# EAGLE design arduino_motor_shield (EAGLE 5.06)
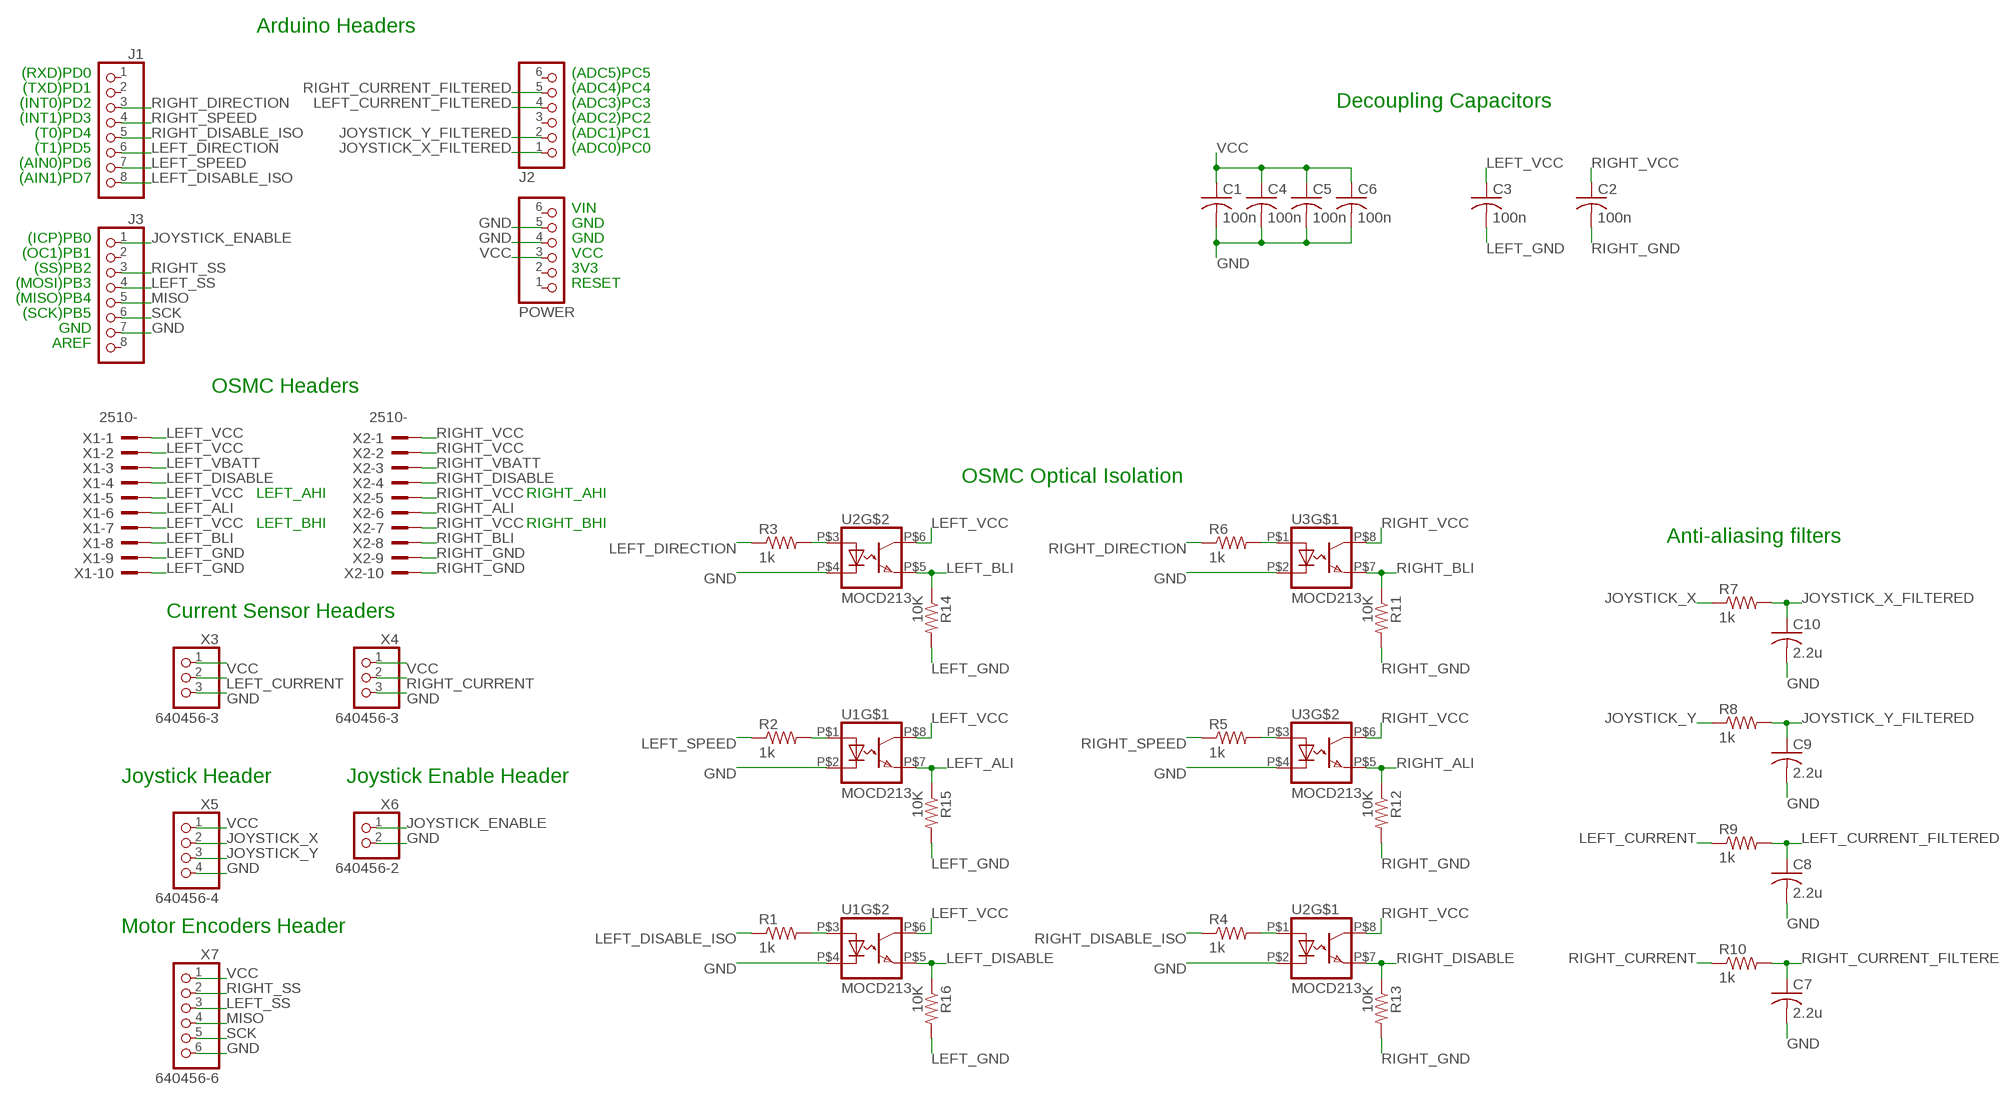
[diagram p0: schematic, sheet 1]

## Parts
C1  100n  C-USC0603  [C0603]
C2  100n  C-USC0603  [C0603]
C3  100n  C-USC0603  [C0603]
C4  100n  C-USC0603  [C0603]
C5  100n  C-USC0603  [C0603]
C6  100n  C-USC0603  [C0603]
C7  2.2u  C-USC0603  [C0603]
C8  2.2u  C-USC0603  [C0603]
C9  2.2u  C-USC0603  [C0603]
C10  2.2u  C-USC0603  [C0603]
J1  PINHD-1X8  [1X08]
J2  PINHD-1X6  [1X06]
J3  PINHD-1X8  [1X08]
POWER  PINHD-1X6  [1X06]
R1  1k  R-US_R0603  [R0603]
R2  1k  R-US_R0603  [R0603]
R3  1k  R-US_R0603  [R0603]
R4  1k  R-US_R0603  [R0603]
R5  1k  R-US_R0603  [R0603]
R6  1k  R-US_R0603  [R0603]
R7  1k  R-US_R0603  [R0603]
R8  1k  R-US_R0603  [R0603]
R9  1k  R-US_R0603  [R0603]
R10  1k  R-US_R0603  [R0603]
R11  10K  R-US_R0603  [R0603]
R12  10K  R-US_R0603  [R0603]
R13  10K  R-US_R0603  [R0603]
R14  10K  R-US_R0603  [R0603]
R15  10K  R-US_R0603  [R0603]
R16  10K  R-US_R0603  [R0603]
U1  MOCD213  [SOIC-8]
U2  MOCD213  [SOIC-8]
U3  MOCD213  [SOIC-8]
X1  2510-  [PAK100/2500-10]
X2  2510-  [PAK100/2500-10]
X3  640456-3  [22-23-2031]
X4  640456-3  [22-23-2031]
X5  640456-4  [22-23-2041]
X6  640456-2  [22-23-2021]
X7  640456-6  [22-23-2061]

## Nets
GND: C1.2 C4.2 C5.2 C6.2 C7.2 C8.2 C9.2 C10.2 J3.7 POWER.4 POWER.5 U1.P$2(C) U1.P$4(C) U2.P$2(C) U2.P$4(C) U3.P$2(C) U3.P$4(C) X3.3 X4.3 X5.4 X6.2 X7.6
JOYSTICK_ENABLE: J3.1 X6.1
JOYSTICK_X: R7.1 X5.2
JOYSTICK_X_FILTERED: C10.1 J2.1 R7.2
JOYSTICK_Y: R8.1 X5.3
JOYSTICK_Y_FILTERED: C9.1 J2.2 R8.2
LEFT_ALI: R15.1 U1.P$7(EMIT) X1.6
LEFT_BLI: R14.1 U2.P$5(EMIT) X1.8
LEFT_CURRENT: R9.1 X3.2
LEFT_CURRENT_FILTERED: C8.1 J2.4 R9.2
LEFT_DIRECTION: J1.6 R3.1
LEFT_DISABLE: R16.1 U1.P$5(EMIT) X1.4
LEFT_DISABLE_ISO: J1.8 R1.1
LEFT_GND: C3.2 R14.2 R15.2 R16.2 X1.9 X1.10
LEFT_SPEED: J1.7 R2.1
LEFT_SS: J3.4 X7.3
LEFT_VBATT: X1.3
LEFT_VCC: C3.1 U1.P$6(COL) U1.P$8(COL) U2.P$6(COL) X1.1 X1.2 X1.5 X1.7
MISO: J3.5 X7.4
N$3: R2.2 U1.P$1(A)
N$8: R3.2 U2.P$3(A)
N$11: R6.2 U3.P$1(A)
N$14: R4.2 U2.P$1(A)
N$17: R1.2 U1.P$3(A)
N$20: R5.2 U3.P$3(A)
RIGHT_ALI: R12.1 U3.P$5(EMIT) X2.6
RIGHT_BLI: R11.1 U3.P$7(EMIT) X2.8
RIGHT_CURRENT: R10.1 X4.2
RIGHT_CURRENT_FILTERED: C7.1 J2.5 R10.2
RIGHT_DIRECTION: J1.3 R6.1
RIGHT_DISABLE: R13.1 U2.P$7(EMIT) X2.4
RIGHT_DISABLE_ISO: J1.5 R4.1
RIGHT_GND: C2.2 R11.2 R12.2 R13.2 X2.9 X2.10
RIGHT_SPEED: J1.4 R5.1
RIGHT_SS: J3.3 X7.2
RIGHT_VBATT: X2.3
RIGHT_VCC: C2.1 U2.P$8(COL) U3.P$6(COL) U3.P$8(COL) X2.1 X2.2 X2.5 X2.7
SCK: J3.6 X7.5
VCC: C1.1 C4.1 C5.1 C6.1 POWER.3 X3.1 X4.1 X5.1 X7.1
Unconnected: J1.1 J1.2 J2.3 J2.6 J3.2 J3.8 POWER.1 POWER.2 POWER.6

## Notes on the sheet
- Arduino Headers
- (RXD)PD0 | (ADC5)PC5
- (TXD)PD1 | (ADC4)PC4
- (INT0)PD2 | (ADC3)PC3 | Decoupling Capacitors
- (INT1)PD3 | (ADC2)PC2
- (T0)PD4 | (ADC1)PC1
- (T1)PD5 | (ADC0)PC0
- (AIN0)PD6
- (AIN1)PD7
- VIN
- GND
- (ICP)PB0 | GND
- (OC1)PB1 | VCC
- (SS)PB2 | 3V3
- (MOSI)PB3 | RESET
- (MISO)PB4
- (SCK)PB5
- GND
- AREF
- OSMC Headers
- OSMC Optical Isolation
- LEFT_AHI | RIGHT_AHI
- LEFT_BHI | RIGHT_BHI
- Anti-aliasing filters
- Current Sensor Headers
- Joystick Header | Joystick Enable Header
- Motor Encoders Header

## Library data of the parts
C1-C10 = rcl:C-US: CAPACITOR, American symbol
J1 J3 = pinhead:PINHD-1X8: PIN HEADER
J2 POWER = pinhead:PINHD-1X6: PIN HEADER
R1-R16 = rcl:R-US_: RESISTOR, American symbol
U1-U3 = mocd213:MOCD213
X1 X2 = con-3m:2510-: 3M (TM) Pak 100 4-Wall Header Source: 3M
X3 X4 = con-tycoelectronics:640456-3
X5 = con-tycoelectronics:640456-4
X6 = con-tycoelectronics:640456-2
X7 = con-tycoelectronics:640456-6

## Board
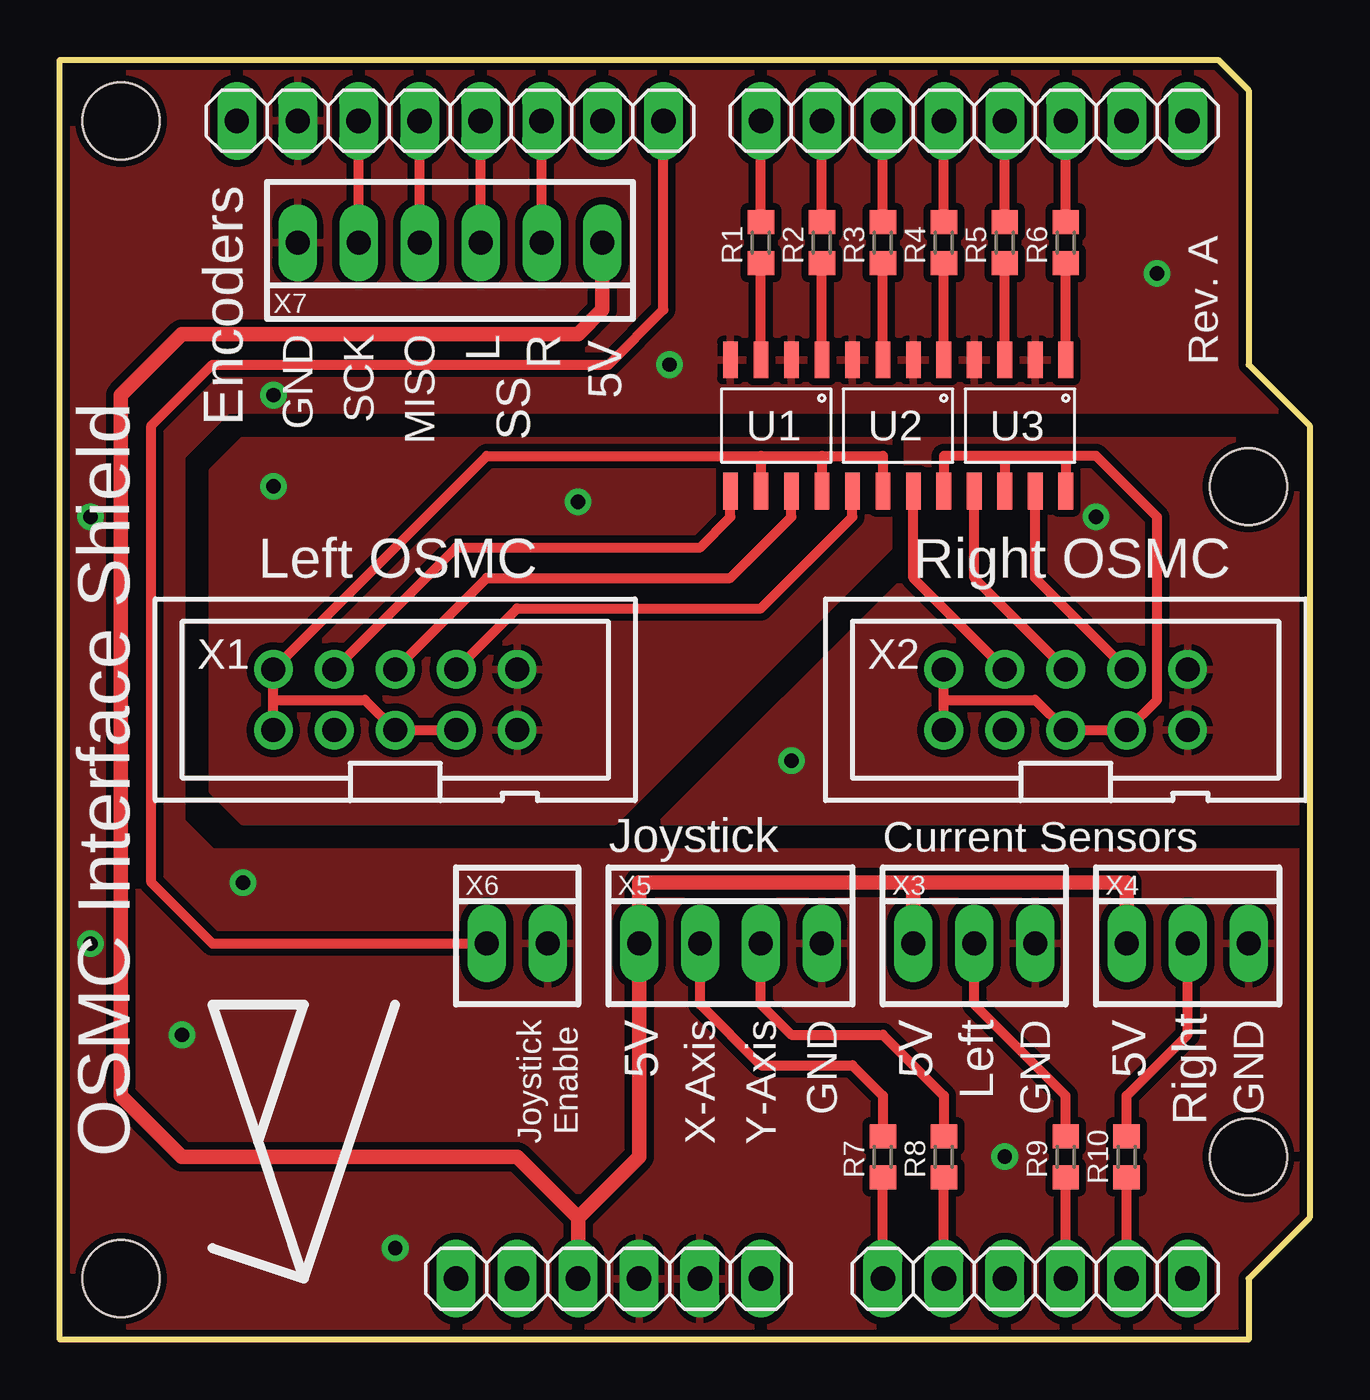
[diagram p1: board, top side]
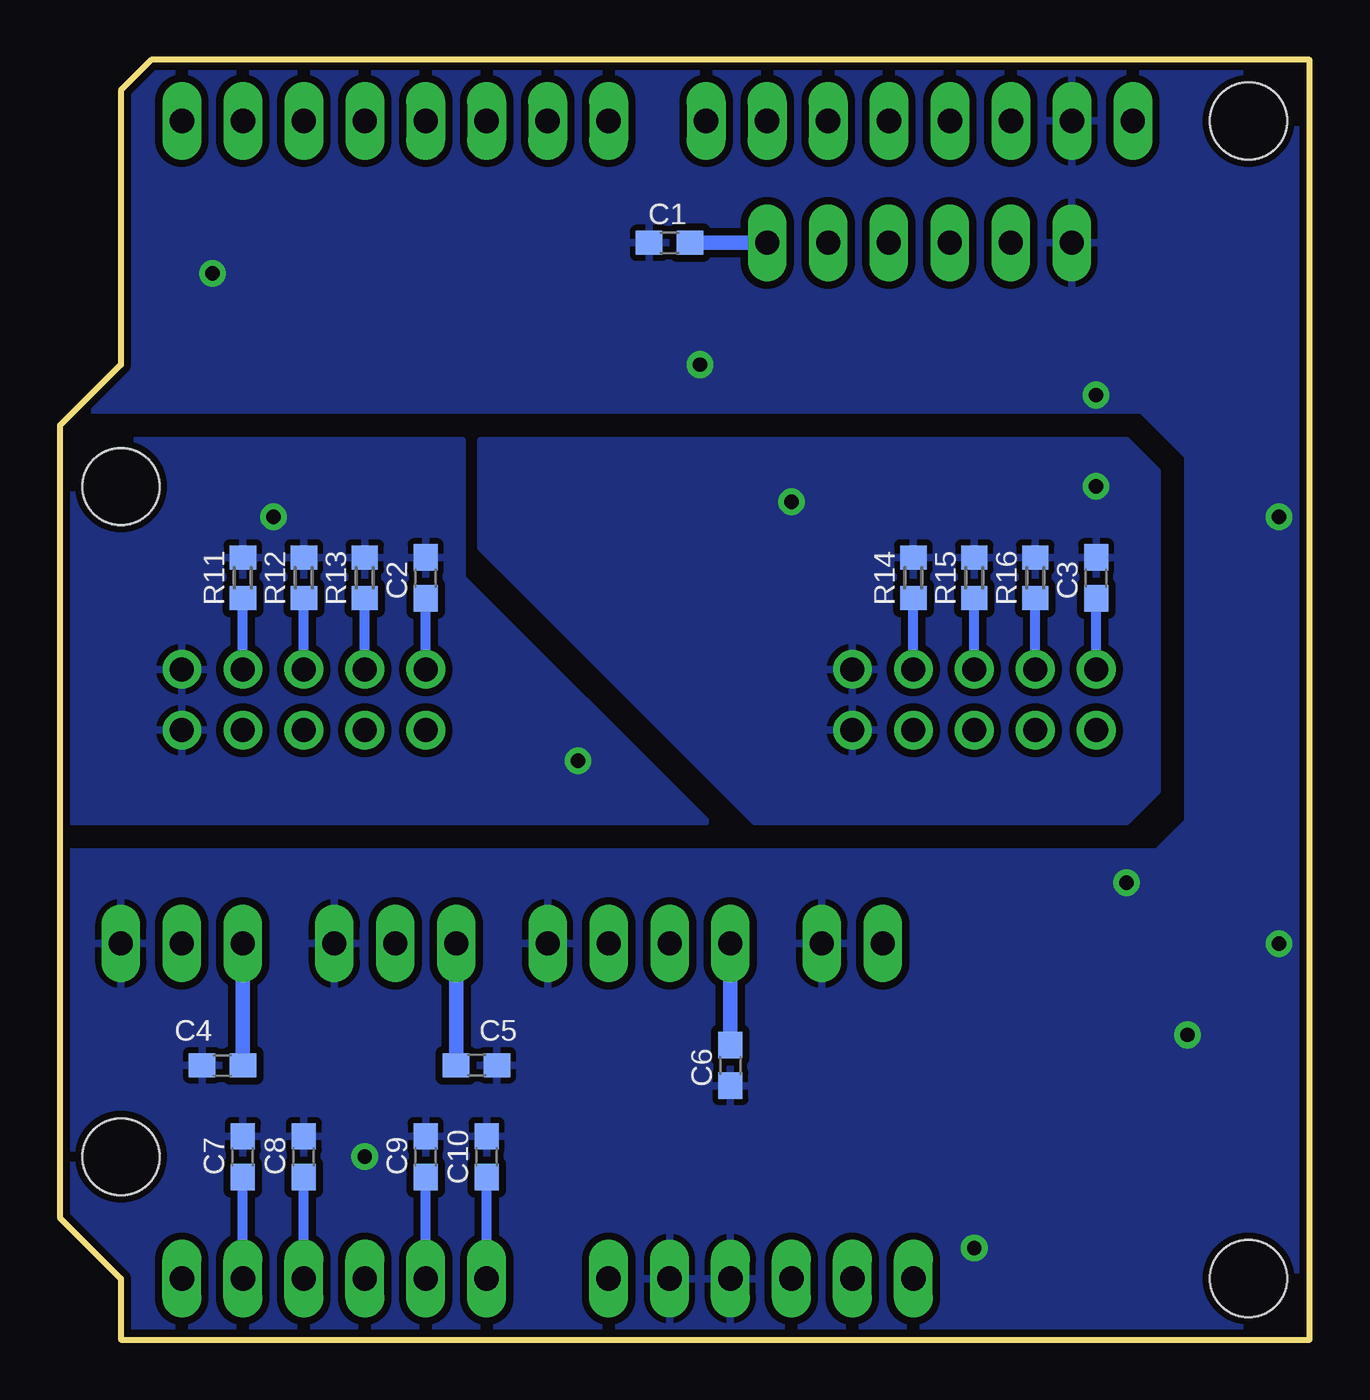
[diagram p2: board, bottom side, seen from below]

Size 52.07 x 53.34 mm. Coordinates in mm from the lower left corner, seen from the top.
Outline: 0,53.34 48.26,53.34 49.53,52.07 49.53,40.64 52.07,38.1 52.07,5.08 49.53,2.54 49.53,0 0,0 0,53.34
Copper layers (1*16): Top 0.035mm / dielectric 1.5mm / Bottom 0.035mm
Design rules "SparkFun": minimum track width 8mil, minimum drill 20mil, track to track 8mil, track to pad 8mil, pad to pad 8mil, via to via 8mil, smd to smd 8mil, copper to edge 10mil, drill to drill 8mil, minimum pad ring 12mil, minimum via ring 10mil, stop-mask expansion 4mil, vias tented up to drill 25mil, thermal gap 10mil
Holes 3.2 mm at 49.53,35.56 49.53,7.62 2.54,50.8 2.54,2.54

### Footprints (pad centres in the part's own frame; a part is rotated, then mirrored left to right if it is on the bottom)
C0603 = smd 1.1 x 1: 1 -0.85,0; 2 0.85,0
1X08 = drill 1.016 long: 1 -8.89,0; 2 -6.35,0; 3 -3.81,0; 4 -1.27,0; 5 1.27,0; 6 3.81,0; 7 6.35,0; 8 8.89,0
1X06 = drill 1.016 long: 1 -6.35,0; 2 -3.81,0; 3 -1.27,0; 4 1.27,0; 5 3.81,0; 6 6.35,0
R0603 = smd 1 x 1.1: 1 -0.85,0; 2 0.85,0
SOIC-8 = smd 1.524 x 0.61: P$1 -2.731,1.27; P$2 -2.731,0; P$3 -2.731,-1.27; P$4 -2.731,-2.54; P$5 2.731,-2.54; P$6 2.731,-1.27; P$7 2.731,0; P$8 2.731,1.27
PAK100/2500-10 = drill 1 pad 1.422 round: 1 -5.08,-1.27; 2 -5.08,1.27; 3 -2.54,-1.27; 4 -2.54,1.27; 5 0,-1.27; 6 0,1.27; 7 2.54,-1.27; 8 2.54,1.27; 9 5.08,-1.27; 10 5.08,1.27
22-23-2031 = drill 1 long: 1 -2.54,0; 2 0,0; 3 2.54,0
22-23-2041 = drill 1 long: 1 -3.81,0; 2 -1.27,0; 3 1.27,0; 4 3.81,0
22-23-2021 = drill 1 long: 1 -1.27,0; 2 1.27,0
22-23-2061 = drill 1 long: 1 -6.35,0; 2 -3.81,0; 3 -1.27,0; 4 1.27,0; 5 3.81,0; 6 6.35,0

### Placement (x,y rotation side)
C1  26.67,45.72 180 bottom
C2  36.83,31.75 90 bottom
C3  8.89,31.75 90 bottom
C4  45.3,11.43 180 bottom
C5  34.71,11.43 0 bottom
C6  24.13,11.43 270 bottom
C7  44.45,7.62 90 bottom
C8  41.91,7.62 90 bottom
C9  36.83,7.62 90 bottom
C10  34.29,7.62 90 bottom
J1  38.1,50.8 180 top
J2  40.64,2.54 0 top
J3  16.26,50.8 180 top
POWER  22.86,2.54 0 top
R1  29.21,45.72 270 top
R2  31.75,45.72 270 top
R3  34.29,45.72 270 top
R4  36.83,45.72 270 top
R5  39.37,45.72 270 top
R6  41.91,45.72 270 top
R7  34.29,7.62 270 top
R8  36.83,7.62 270 top
R9  41.91,7.62 270 top
R10  44.45,7.62 270 top
R11  44.45,31.75 90 bottom
R12  41.91,31.75 90 bottom
R13  39.37,31.75 90 bottom
R14  16.51,31.75 90 bottom
R15  13.97,31.75 90 bottom
R16  11.43,31.75 90 bottom
U1  30.48,38.1 270 top
U2  35.56,38.1 270 top
U3  40.64,38.1 270 top
X1  13.97,26.67 0 top
X2  41.91,26.67 0 top
X3  38.1,16.51 0 top
X4  46.99,16.51 0 top
X5  27.94,16.51 0 top
X6  19.05,16.51 0 top
X7  16.26,45.72 180 top

### Tracks (layer width: path | path; a pad name or v marks a point on that pad's centre or on a via)
GND  (via drill 0.6)
  other vias: 45.72,44.45 7.62,19.05 5.08,12.7 13.97,3.81 25.4,40.64 1.27,16.51 1.27,34.29 8.89,39.37 39.37,7.62
  pour Bottom (isolate 0.305): 52.07,20.32 6.35,20.32 5.08,21.59 5.08,36.83 6.99,38.73 51.44,38.73 49.53,40.64 49.53,52.07 48.26,53.34 0,53.34 0,0 49.53,0 49.53,2.54 52.07,5.08
  pour Top (isolate 0.305): 48.26,53.34 0,53.34 0,0 49.53,0 49.53,2.54 52.07,5.08 52.07,20.32 6.35,20.32 5.08,21.59 5.08,36.83 6.99,38.73 51.44,38.73 49.53,40.64 49.53,52.07
JOYSTICK_ENABLE
  Top 0.406: J3.1 25.15,42.93 22.86,40.64 6.35,40.64 3.81,38.1 3.81,19.05 6.35,16.51 X6.1
JOYSTICK_X
  Top 0.406: X5.2 26.67,13.97 29.21,11.43 33.02,11.43 34.29,10.16 R7.1
JOYSTICK_X_FILTERED
  Top 0.406: J2.1 C10.1
  Bottom 0.406: J2.1 C10.1
JOYSTICK_Y
  Top 0.406: X5.3 29.21,13.97 30.48,12.7 34.29,12.7 36.83,10.16 R8.1
JOYSTICK_Y_FILTERED
  Top 0.406: J2.2 C9.1
  Bottom 0.406: J2.2 C9.1
LEFT_ALI
  Top 0.406: U1.P$7 30.48,34.29 27.94,31.75 17.78,31.75 X1.6
  Bottom 0.406: X1.6 R15.1
LEFT_BLI
  Top 0.406: U2.P$5 33.02,34.29 29.21,30.48 19.05,30.48 X1.8
  Bottom 0.406: X1.8 R14.1
LEFT_CURRENT
  Top 0.406: R9.1 41.91,10.16 38.1,13.97 X3.2
LEFT_CURRENT_FILTERED
  Top 0.406: J2.4 C8.1
  Bottom 0.406: J2.4 C8.1
LEFT_DIRECTION
  Top 0.406: R3.1 J1.6
LEFT_DISABLE
  Top 0.406: U1.P$5 27.94,34.29 26.67,33.02 16.51,33.02 X1.4
  Bottom 0.406: X1.4 R16.1
LEFT_DISABLE_ISO
  Top 0.406: R1.1 J1.8
LEFT_GND  (via drill 0.6)
  other vias: 21.59,34.92 8.89,35.56
  pour Bottom (isolate 0.305): 34.54,37.47 34.54,33.02 23.11,21.59 7.62,21.59 6.35,22.86 6.35,36.2 7.62,37.47
  pour Top (isolate 0.305): 34.54,37.47 34.54,33.02 23.11,21.59 7.62,21.59 6.35,22.86 6.35,36.2 7.62,37.47
LEFT_SPEED
  Top 0.406: R2.1 J1.7
LEFT_SS
  Top 0.406: X7.3 J3.4
LEFT_VCC
  Top 0.406: 31.75,36.83 U1.P$8 | 29.21,36.83 31.75,36.83 | 29.21,36.83 U1.P$6 | U2.P$6 34.29,36.83 31.75,36.83 | X1.7 X1.5 12.7,26.67 8.89,26.67 | X1.1 8.89,26.67 | 8.89,26.67 X1.2 17.78,36.83 29.21,36.83
  Bottom 0.406: X1.2 C3.1
MISO
  Top 0.406: X7.4 J3.5
N$3
  Top 0.406: U1.P$1 R2.2
N$8
  Top 0.406: U2.P$3 R3.2
N$11
  Top 0.406: U3.P$1 R6.2
N$14
  Top 0.406: U2.P$1 R4.2
N$17
  Top 0.406: U1.P$3 R1.2
N$20
  Top 0.406: U3.P$3 R5.2
RIGHT_ALI
  Top 0.406: U3.P$5 38.1,31.75 X2.6
  Bottom 0.406: X2.6 R12.1
RIGHT_BLI
  Top 0.406: U3.P$7 40.64,31.75 X2.8
  Bottom 0.406: X2.8 R11.1
RIGHT_CURRENT
  Top 0.406: X4.2 46.99,12.7 44.45,10.16 R10.1
RIGHT_CURRENT_FILTERED
  Top 0.406: J2.5 C7.1
  Bottom 0.406: J2.5 C7.1
RIGHT_DIRECTION
  Top 0.406: R6.1 J1.3
RIGHT_DISABLE
  Top 0.406: U2.P$7 35.56,31.75 X2.4
  Bottom 0.406: X2.4 R13.1
RIGHT_DISABLE_ISO
  Top 0.406: R4.1 J1.5
RIGHT_GND  (via drill 0.6)
  other vias: 43.18,34.29 30.48,24.13
  pour Bottom (isolate 0.305): 35.31,37.47 52.07,37.47 52.07,21.59 25.15,21.59 35.31,31.75
  pour Top (isolate 0.305): 35.31,37.47 52.07,37.47 52.07,21.59 25.15,21.59 35.31,31.75
RIGHT_SPEED
  Top 0.406: R5.1 J1.4
RIGHT_SS
  Top 0.406: X7.2 J3.3
RIGHT_VCC
  Top 0.406: 41.91,36.83 U3.P$8 | 41.91,36.83 39.37,36.83 | U2.P$8 36.83,36.83 39.37,36.83 | 39.37,36.83 U3.P$6 | 36.83,26.67 40.64,26.67 X2.5 X2.7 45.72,26.67 45.72,34.29 43.18,36.83 41.91,36.83 | 36.83,26.67 X2.2 | X2.1 36.83,26.67
  Bottom 0.406: X2.2 C2.1
SCK
  Top 0.406: X7.5 J3.6
VCC
  Top 0.61: X7.1 22.61,42.93 21.59,41.91 5.08,41.91 2.54,39.37 2.54,10.16 5.08,7.62 17.78,7.62 19.05,7.62 21.59,5.08 | 35.56,19.05 24.13,19.05 X5.1 24.13,7.62 21.59,5.08 | 35.56,19.05 44.45,19.05 X4.1 | 35.56,19.05 X3.1 | 21.59,5.08 POWER.3
  Bottom 0.61: X5.1 C6.1 | X7.1 C1.1 | X3.1 C5.1 | X4.1 C4.1

### Text on the board
tPlace: GND | SCK | MISO | L | R | 5V | Rev. A | SS | Encoders | Left OSMC | Right OSMC | Joystick | Current Sensors | Right | Joystick | Enable | 5V | X-Axis | Y-Axis | GND | 5V | Left | GND | 5V | GND | OSMC Interface Shield